# EAGLE design shock dyno (EAGLE 9.6.2)
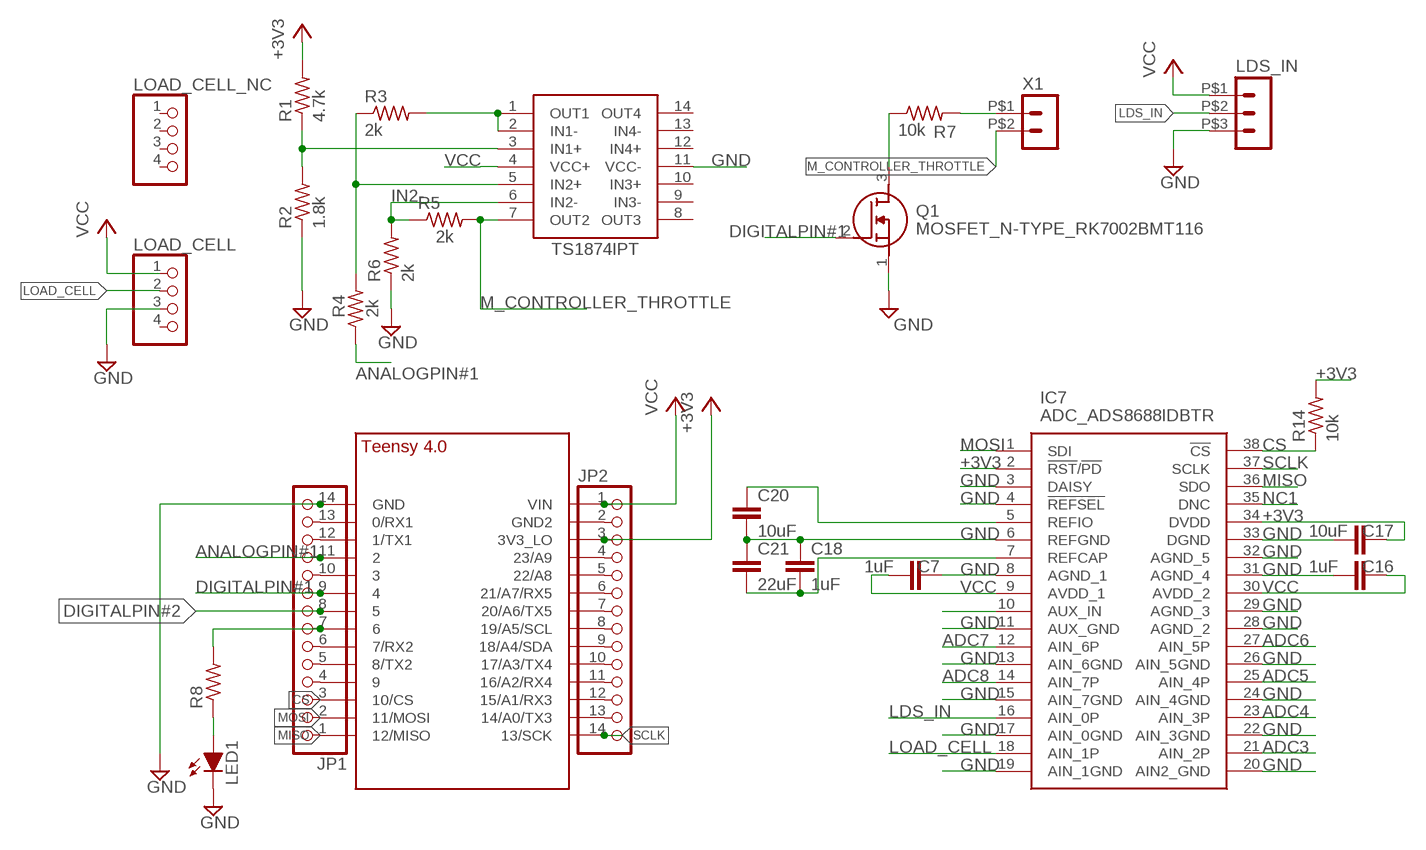
[diagram p0: schematic, sheet 1]

## Parts
C7  1uF  CAP_SMDC0603  [C0603]
C16  1uF  CAP_SMDC0603  [C0603]
C17  10uF  CAP_SMDC0603  [C0603]
C18  1uF  CAP_SMDC0603  [C0603]
C20  10uF  CAP_SMDC0805  [C0805]
C21  22uF  CAP_SMDC1210  [C1210]
IC7  ADC_ADS8688IDBTR  [SOP50P640X120-38N]
JP1  PINHD-1X14  [1X14]
JP2  PINHD-1X14  [1X14]
LDS_IN  HEADER_POS3_43650-0300  [43650-0300]
LED1  LED-5MM  [LED-5MM]
LOAD_CELL  PINHD-1X4  [1X04]
LOAD_CELL_NC  PINHD-1X4  [1X04]
Q1  MOSFET_N-TYPE_RK7002BMT116  [BSS64AHZGT116]
R1  4.7k  RES_SMDR0603  [R0603]
R2  1.8k  RES_SMDR0603  [R0603]
R3  2k  RES_SMDR0603  [R0603]
R4  2k  RES_SMDR0603  [R0603]
R5  2k  RES_SMDR0603  [R0603]
R6  2k  RES_SMDR0603  [R0603]
R7  10k  RES_SMDR0603  [R0603]
R8  RES_SMDR0603  [R0603]
R14  10k  RES_SMDR0603  [R0603]
U$1  TS1874IPT  [TSSOP14]
U$2  TEENSY_4.0_SIMPLE  [TEENSY_4.0_SIMPLE]
X1  HEADER_POS2_43650-0200  [43650-0200]

## Nets
+3V3: C17.1 IC7.2(!RST!/!PD) IC7.34(DVDD) JP2.3 R1.2 R14.2 U$2.3V3_LO
ADC3: IC7.21(AIN_2P)
ADC4: IC7.23(AIN_3P)
ADC5: IC7.25(AIN_4P)
ADC6: IC7.27(AIN_5P)
ADC7: IC7.12(AIN_6P)
ADC8: IC7.14(AIN_7P)
ANALOGPIN#1: JP1.11 R4.1 U$2.2
CS: IC7.38(!CS) JP1.3 R14.1 U$2.10/CS
DIGITALPIN#1: JP1.9 Q1.2(G) U$2.4/CANRX
DIGITALPIN#2: JP1.8 U$2.5
GND: C7.1 C16.2 C17.2 C18.1 C20.2 C21.1 IC7.3(DAISY) IC7.4(!REFSEL) IC7.6(REFGND) IC7.8(AGND_1) IC7.11(AUX_GND) IC7.13(AIN_6GND) IC7.15(AIN_7GND) IC7.17(AIN_0GND) IC7.19(AIN_1GND) IC7.20(AIN2_GND) IC7.22(AIN_3GND) IC7.24(AIN_4GND) IC7.26(AIN_5GND) IC7.28(AGND_2) IC7.29(AGND_3) IC7.31(AGND_4) IC7.32(AGND_5) IC7.33(DGND) JP1.14 LDS_IN.P$3 LED1.K(C) LOAD_CELL.3 Q1.1(S) R2.1 R6.1 U$1.11(VCC-) U$2.GND
IN2-: R5.1 R6.2 U$1.6(IN2-)
LDS_IN: IC7.16(AIN_0P) LDS_IN.P$2
LOAD_CELL: IC7.18(AIN_1P) LOAD_CELL.2
M_CONTROLLER_THROTTLE: R5.2 U$1.7(OUT2) X1.P$2
MISO: IC7.36(SDO) JP1.1 U$2.12/MISO
MOSI: IC7.1(SDI) JP1.2 U$2.11/MOSI
N$1: R1.1 R2.2 U$1.3(IN1+)
N$2: R3.1 R4.2 U$1.5(IN2+)
N$3: R3.2 U$1.1(OUT1) U$1.2(IN1-)
N$4: R7.2 X1.P$1
N$5: JP1.4 U$2.9/CS
N$6: JP1.5 U$2.8(8/TX2)
N$7: JP1.10 U$2.3/CANTX
N$8: JP1.6 U$2.7(7/RX2)
N$10: Q1.3(D) R7.1
N$11: LED1.A R8.1
N$13: JP1.7 R8.2 U$2.6
N$14: JP1.12 U$2.1/TX(1/TX1)
N$15: JP1.13 U$2.0/RX(0/RX1)
N$16: JP2.2 U$2.GND2
N$17: JP2.4 U$2.23/A9
N$18: JP2.5 U$2.22/A8
N$19: JP2.6 U$2.21/A7(21/A7/RX5)
N$20: JP2.7 U$2.20/A6(20/A6/TX5)
N$21: JP2.8 U$2.19/A5/SCL
N$22: JP2.9 U$2.18/A4/SDA
N$23: JP2.10 U$2.17/A3(17/A3/TX4)
N$24: JP2.11 U$2.16/A2(16/A2/RX4)
N$25: JP2.12 U$2.15/A1(15/A1/RX3)
N$26: JP2.13 U$2.14/A0(14/A0/TX3)
N$29: C18.2 C21.2 IC7.7(REFCAP)
N$30: IC7.10(AUX_IN)
N$31: C20.1 IC7.5(REFIO)
NC1: IC7.35(DNC)
SCLK: IC7.37(SCLK) JP2.14 U$2.13/SCK
VCC: C7.2 C16.1 IC7.9(AVDD_1) IC7.30(AVDD_2) JP2.1 LDS_IN.P$1 LOAD_CELL.1 U$1.4(VCC+) U$2.VIN
Unconnected: LOAD_CELL.4 LOAD_CELL_NC.1 LOAD_CELL_NC.2 LOAD_CELL_NC.3 LOAD_CELL_NC.4 U$1.8(OUT3) U$1.9(IN3-) U$1.10(IN3+) U$1.12(IN4+) U$1.13(IN4-) U$1.14(OUT4)

## Library data of the parts
C7 C16-C18 C20 C21 = GTOR - Passive Components:CAP_SMD: CAPACITOR, European symbol; SPICEPREFIX: C
IC7 = GTOR - Active Components:ADC_ADS8688IDBTR: Octal Channel Single ADC SAR 500ksps 16-bit Serial 38-Pin TSSOP T/R Source: Datasheet <https://www.arrow.com/en/products/ads8688idbtr/texas-instruments>; ARROW_PART_NUMBER: ADS8688IDBTR; ARROW_PRICE-STOCK: https://www.arrow.com/en/products/ads8688idbtr/texas-instruments?region=nac; DESCRIPTION: Octal Channel Single ADC SAR 500ksps 16-bit Serial 38-Pin TSSOP T/R; HEIGHT: 1.2mm; MANUFACTURER_NAME: Texas Instruments; MANUFACTURER_PART_NUMBER: ADS8688IDBTR; MOUSER_PART_NUMBER: 595-ADS8688IDBTR; MOUSER_PRICE-STOCK: https://www.mouser.co.uk/ProductDetail/Texas-Instruments/ADS8688IDBTR?qs=bZA2O%252B%252B1GJuPFEagMJIgMw%3D%3D
JP1 JP2 = GTOR - Connectors:PINHD-1X14: PIN HEADER
LDS_IN = GTOR - Microfit Connector:HEADER_POS3_?: Molex - Micro-Fit 3.0 Series connector, 3.00mm (0.118") pitch header, 3 positions.
LED1 = GTOR - Passive Components:LED: Light Emitting Diode (LED) Source: Dangerous Prototypes Eagle Library <https://github.com/DangerousPrototypes/Eagle_Part_Library>
LOAD_CELL LOAD_CELL_NC = GTOR - Connectors:PINHD-1X4: PIN HEADER
Q1 = GTOR - Active Components:MOSFET_N-TYPE_RK7002BMT116: 2.5V Drive Nch MOSFET: MOSFETs are made as ultra-low ON-resistance by the micro-processing technologies suitable for mobilr equipment for low current consumption. In wide lineup including compact type, high-power type and complex type to meet in the market. Source: Datasheet <https://datasheet.datasheetarchive.com/originals/distributors/DKDS-18/356920.pdf>; DESCRIPTION: 2.5V Drive Nch MOSFET: MOSFETs are made as ultra-low ON-resistance by the micro-processing technologies suitable for mobilr equipment for low current consumption. In wide lineup including compact type, high-power type and complex type to meet in the market.; HEIGHT: 1.2mm; MANUFACTURER_NAME: ROHM Semiconductor; MANUFACTURER_PART_NUMBER: RK7002BMT116; MOUSER_PART_NUMBER: 755-RK7002BMT116; MOUSER_PRICE-STOCK: https://www.mouser.co.uk/ProductDetail/ROHM-Semiconductor/RK7002BMT116?qs=npTsUczJOtO4aXz%2Fx%2FNVUw%3D%3D
R1-R8 R14 = GTOR - Passive Components:RES_SMD: RESISTOR, American symbol; SPICEPREFIX: R
U$1 = GTOR - Active Components:TS1874IPT
U$2 = GTOR - Microcontroller:TEENSY_4.0_SIMPLE
X1 = GTOR - Microfit Connector:HEADER_POS2_?: Molex - Micro-Fit 3.0 Series connector, 3.00mm (0.118") pitch header, 2 positions.

## Board
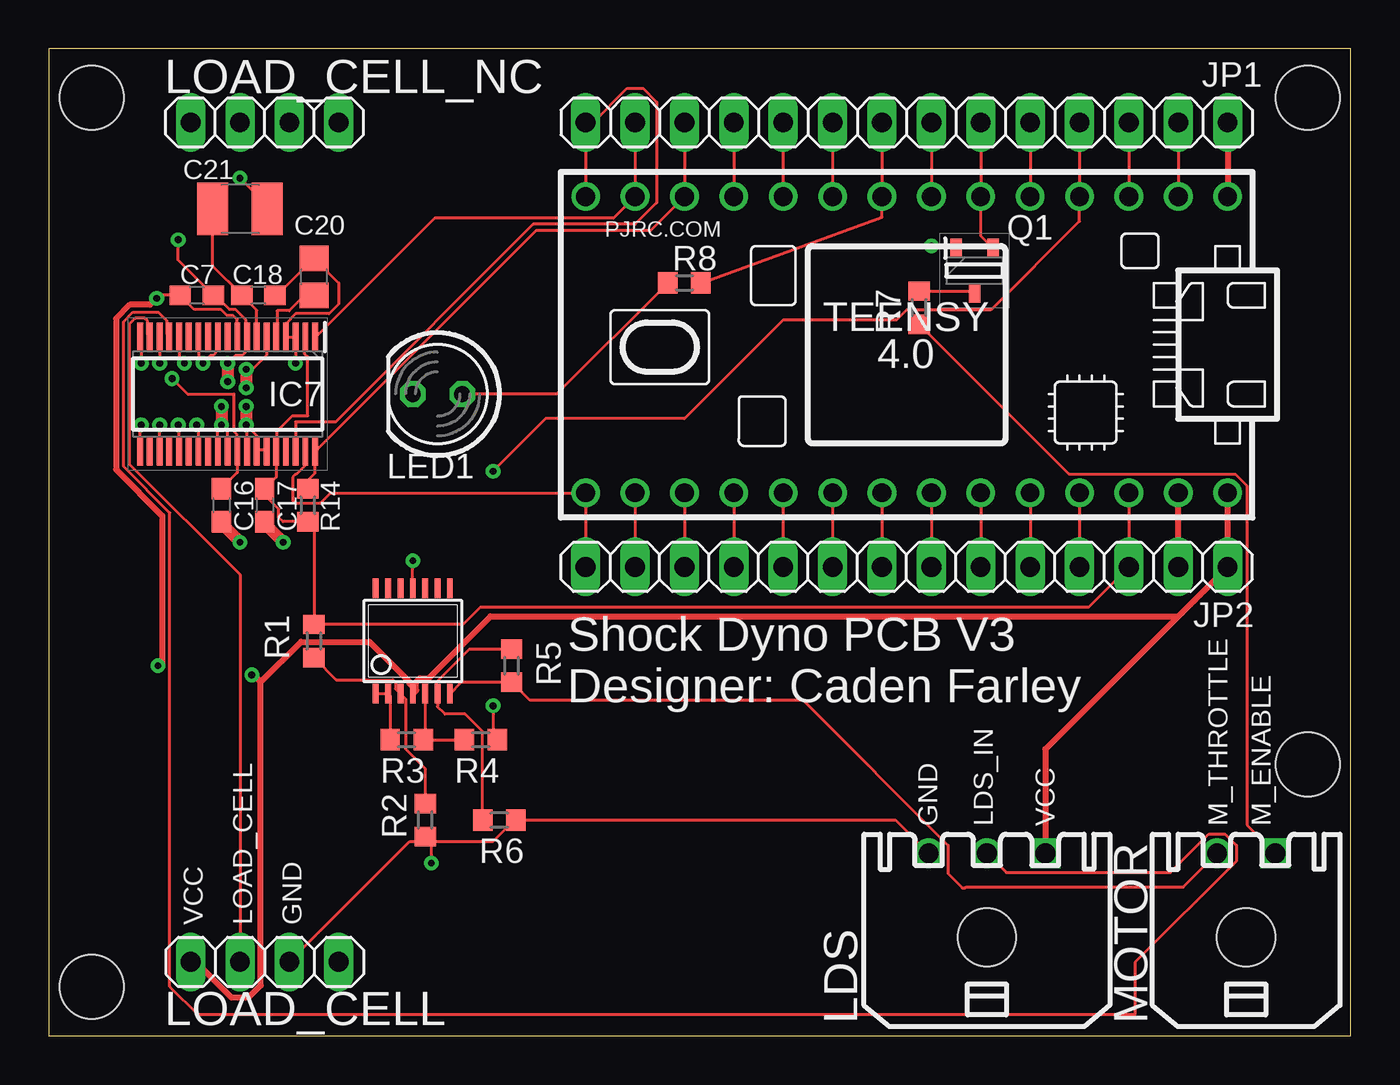
[diagram p1: board, top side]
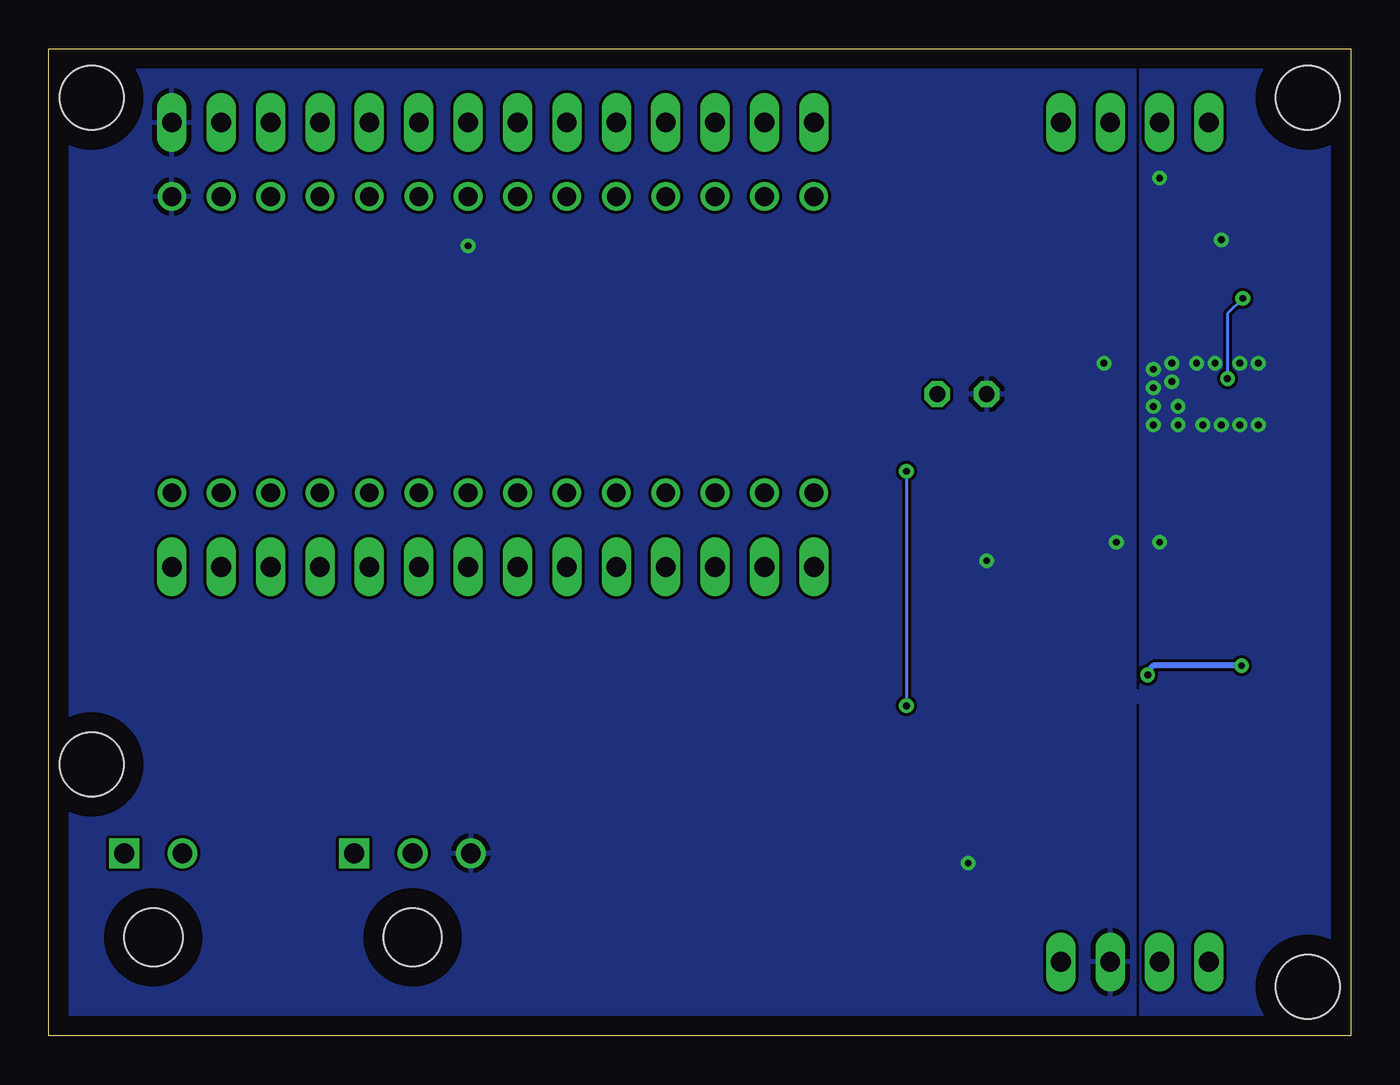
[diagram p2: board, bottom side, seen from below]

Size 66.98 x 50.79 mm. Coordinates in mm from the lower left corner, seen from the top.
Outline: 0,0 66.98,0 66.98,50.79 0,50.79 0,0
Copper layers (1*16): Top 0.035mm / dielectric 1.5mm / Bottom 0.035mm
Design rules "default": minimum track width 6mil, minimum drill 0.35mm, track to track 6mil, track to pad 6mil, pad to pad 6mil, via to via 6mil, smd to smd 6mil, copper to edge 40mil, drill to drill 6mil, minimum pad ring 10mil, minimum via ring 8mil, stop-mask expansion 4mil, vias tented up to drill 0mil, thermal gap 10mil
Holes 3.3 mm at 2.22,48.26 64.77,48.26 2.22,2.54 64.77,13.97

### Footprints (pad centres in the part's own frame; a part is rotated, then mirrored left to right if it is on the bottom)
C0603 = smd 1.1 x 1: 1 -0.85,0; 2 0.85,0
C0805 = smd 1.3 x 1.5: 1 -0.95,0; 2 0.95,0
C1210 = smd 1.6 x 2.7: 1 -1.4,0; 2 1.4,0
SOP50P640X120-38N = smd 1.475 x 0.3: 1 -2.938,4.5; 2 -2.938,4; 3 -2.938,3.5; 4 -2.938,3; 5 -2.938,2.5; 6 -2.938,2; 7 -2.938,1.5; 8 -2.938,1; 9 -2.938,0.5; 10 -2.938,0; 11 -2.938,-0.5; 12 -2.938,-1; 13 -2.938,-1.5; 14 -2.938,-2; 15 -2.938,-2.5; 16 -2.938,-3; 17 -2.938,-3.5; 18 -2.938,-4; 19 -2.938,-4.5; 20 2.938,-4.5; 21 2.938,-4; 22 2.938,-3.5; 23 2.938,-3; 24 2.938,-2.5; 25 2.938,-2; 26 2.938,-1.5; 27 2.938,-1; 28 2.938,-0.5; 29 2.938,0; 30 2.938,0.5; 31 2.938,1; 32 2.938,1.5; 33 2.938,2; 34 2.938,2.5; 35 2.938,3; 36 2.938,3.5; 37 2.938,4; 38 2.938,4.5
1X14 = drill 1.016 long: 1 -16.51,0; 2 -13.97,0; 3 -11.43,0; 4 -8.89,0; 5 -6.35,0; 6 -3.81,0; 7 -1.27,0; 8 1.27,0; 9 3.81,0; 10 6.35,0; 11 8.89,0; 12 11.43,0; 13 13.97,0; 14 16.51,0
43650-0300 = drill 1.02 square: P$1 3,4.32 | drill 1.02: P$2 0,4.32; P$3 -3,4.32 | hole 3: 0,0
LED-5MM = drill 0.813 octagon: A -1.27,0; K 1.27,0
1X04 = drill 1.016 long: 1 -3.81,0; 2 -1.27,0; 3 1.27,0; 4 3.81,0
BSS64AHZGT116 = smd 1 x 0.6: 1 -1.15,-0.95; 2 -1.15,0.95; 3 1.15,0
R0603 = smd 1 x 1.1: 1 -0.85,0; 2 0.85,0
TSSOP14 = smd 0.305 x 0.991: 1 -1.905,-2.718; 2 -1.27,-2.718; 3 -0.635,-2.718; 4 0,-2.718; 5 0.635,-2.718; 6 1.27,-2.718; 7 1.905,-2.718; 8 1.905,2.718; 9 1.27,2.718; 10 0.635,2.718; 11 0,2.718; 12 -0.635,2.718; 13 -1.27,2.718; 14 -1.905,2.718
TEENSY_4.0_SIMPLE = drill 0.965: 0/RX -13.97,-7.62; 1/TX -11.43,-7.62; 2 -8.89,-7.62; 3/CANTX -6.35,-7.62; 3V3_LO -11.43,7.62; 4/CANRX -3.81,-7.62; 5 -1.27,-7.62; 6 1.27,-7.62; 7 3.81,-7.62; 8 6.35,-7.62; 9/CS 8.89,-7.62; 10/CS 11.43,-7.62; 11/MOSI 13.97,-7.62; 12/MISO 16.51,-7.62; 13/SCK 16.51,7.62; 14/A0 13.97,7.62; 15/A1 11.43,7.62; 16/A2 8.89,7.62; 17/A3 6.35,7.62; 18/A4/SDA 3.81,7.62; 19/A5/SCL 1.27,7.62; 20/A6 -1.27,7.62; 21/A7 -3.81,7.62; 22/A8 -6.35,7.62; 23/A9 -8.89,7.62; GND -16.51,-7.62; GND2 -13.97,7.62; VIN -16.51,7.62
43650-0200 = drill 1.02 square: P$1 1.5,4.32 | drill 1.02: P$2 -1.5,4.32 | hole 3: 0,0

### Placement (x,y rotation side)
C7  7.62,38.1 180 top
C16  8.89,27.3 270 top
C17  11.11,27.3 270 top
C18  10.79,38.1 180 top
C20  13.65,39.05 90 top
C21  9.84,42.54 180 top
IC7  9.21,33.02 270 top
JP1  44.13,46.99 0 top
JP2  44.13,24.13 180 top
LDS_IN  48.26,5.08 0 top
LED1  20,33.02 180 top
LOAD_CELL  11.11,3.81 0 top
LOAD_CELL_NC  11.11,46.99 180 top
Q1  47.62,39.37 270 top
R1  13.65,20.32 90 top
R2  19.37,11.11 90 top
R3  18.41,15.24 180 top
R4  22.23,15.24 180 top
R5  23.81,19.05 270 top
R6  23.18,11.11 180 top
R7  44.77,37.46 270 top
R8  32.7,38.73 0 top
R14  13.33,27.3 270 top
U$1  18.73,20.32 0 top
U$2  44.13,35.56 180 top
X1  61.59,5.08 0 top

### Tracks (layer width: path | path; a pad name or v marks a point on that pad's centre or on a via)
+3V3
  Top 0.152: U$2.3V3_LO JP2.3 53.5,22.07 22.23,22.07 21.33,21.17 R1.2 13.65,26.35 13.33,26.35 R14.2 12.06,26.45 11.84,26.67 11.84,27.1 11.11,27.83 C17.1 11.71,28.75 IC7.34 11.75,30.16 11.75,31.12 12.54,31.91 13.33,31.91 13.33,34.92 13.18,35.08 13.18,35.88 IC7.2
ANALOGPIN#1  (via drill 0.35)
  Top 0.152: JP1.11 U$2.2 53.02,41.91 48.46,37.34 44.12,37.34 43.61,36.83 37.78,36.83 32.7,31.75 25.56,31.75 v22.86,29.05 | R4.1 22.86,15.45 v22.86,16.99
  Bottom 0.152: v22.86,29.05 v22.86,16.99
CS
  Top 0.152: JP1.3 U$2.10/CS 30.96,41.43 25.08,41.43 13.81,30.16 IC7.38 13.71,28.95 13.33,28.57 R14.1
DIGITALPIN#1
  Top 0.152: JP1.9 U$2.4/CANRX 47.94,41.15 Q1.2
DIGITALPIN#2
  Top 0.152: JP1.8 U$2.5
GND  (via drill 0.35)
  Top 0.152: v19.69,8.89 19.69,9.95 R2.1 19.69,10 | v12.7,34.61 v12.71,34.62 IC7.3 IC7.4 12.21,36.65 12.7,37.15 14.42,37.15 14.92,37.65 14.92,38.73 C20.2 13.65,39.85 13.49,39.85 11.75,38.1 C18.1 | IC7.31 10.21,31.38 v10.16,31.43 10.71,30.88 IC7.32 10.79,30.16 11.11,30.16 IC7.33 | IC7.29 9.21,31.12 v8.89,31.43 8.71,31.25 IC7.28 | IC7.26 7.71,31.34 v7.62,31.43 | IC7.24 6.71,31.39 v6.67,31.43 | IC7.22 v5.71,31.42 v5.71,31.43 | IC7.20 4.71,31.38 v4.76,31.43 | IC7.19 4.76,35.9 v4.76,34.61 | IC7.17 v5.71,34.61 | IC7.15 6.71,34.88 v6.99,34.61 | IC7.13 7.71,34.84 v7.94,34.61 8.32,34.99 8.45,34.99 8.71,35.25 IC7.11 | v9.21,34.61 9.59,34.99 9.95,34.99 10.21,35.25 IC7.8 10.16,36.01 10.16,36.83 9.62,37.37 9.3,37.37 8.57,38.1 C7.1 6.67,39.9 v6.67,40.96 | IC7.6 11.21,35.02 10.48,34.29 v10.16,34.29 | 19.69,10 22.86,10 23.97,11.11 R6.1 43.55,11.11 LDS_IN.P$3 | U$1.11 v18.73,24.45 | Q1.1 45.52,40.52 v45.4,40.64 | LOAD_CELL.3 18.57,10 19.69,10 | v9.84,44.13 11.24,42.73 C21.1
  Top 0.305: JP1.14 U$2.GND
  Top 0.61: v9.21,34.61 v9.21,33.65 | v10.16,34.29 v10.16,33.34 | v10.16,32.38 v10.16,31.43 | v8.89,32.38 v8.89,31.43 | v9.84,25.4 8.89,26.35 C16.2 | v12.06,25.4 11.11,26.35 C17.2
  pour Bottom (rank 3): -1.27,52.07 -1.27,-1.27 10.79,-1.27 10.79,17.14 11.11,17.14 11.11,-1.27 68.58,-1.27 68.58,52.07 11.11,52.07 11.11,17.78 10.79,17.78 10.79,52.07
IN2-
  Top 0.152: R6.2 22.33,15.66 21.43,16.56 20.39,16.56 19.99,16.96 20,16.97 U$1.6 19.94,17.67 19.94,18.19 21.65,19.9 R5.1
LDS_IN
  Top 0.152: LDS_IN.P$2 49.25,8.41 57.7,8.41 59.68,10.39 60.51,10.39 61.09,9.81 61.09,8.99 55.88,3.78 55.88,1.09 7.68,1.09 6.24,2.54 6.24,26.91 3.85,29.3 3.85,36.74 4.34,37.23 5.65,37.23 6.09,36.79 6.09,36.08 IC7.16
LOAD_CELL
  Top 0.152: IC7.18 5.09,36.08 5.09,36.79 4.95,36.92 4.46,36.92 4.16,36.62 4.16,29.42 9.84,23.74 LOAD_CELL.2
M_CONTROLLER_THROTTLE
  Top 0.152: U$1.7 21.23,18.2 R5.2 24.74,17.28 38.79,17.28 46.25,9.81 46.25,8.36 46.99,7.62 47.13,7.62 47.19,7.67 58.37,7.67 X1.P$2
MISO
  Top 0.152: U$2.12/MISO JP1.1 28,46.99 29.75,48.74 30.57,48.74 31.27,48.04 31.27,42.86 30.16,41.75 24.92,41.75 14.76,31.59 12.7,31.59 12.7,30.16 IC7.36
MOSI
  Top 0.152: JP1.2 U$2.11/MOSI 29.05,42.07 19.84,42.07 13.81,36.04 IC7.1
N$1
  Top 0.152: R1.1 14.8,18.33 17.71,18.33 17.84,18.19 17.84,17.86 U$1.3 18.35,17.35 18.35,14.78 19.37,13.76 R2.2
N$2
  Top 0.152: U$1.5 19.37,15.34 R3.1 R4.2
N$3
  Top 0.152: U$1.1 U$1.2 17.56,17.5 R3.2
N$4
  Top 0.152: R7.2 52.48,28.9 61.04,28.9 61.63,28.31 61.63,10.86 X1.P$1
N$5
  Top 0.152: JP1.4 U$2.9/CS
N$6
  Top 0.152: JP1.5 U$2.8
N$7
  Top 0.152: JP1.10 U$2.3/CANTX
N$8
  Top 0.152: JP1.6 U$2.7
N$10
  Top 0.152: R7.1 47.53,38.31 Q1.3
N$11
  Top 0.152: R8.1 26.14,33.02 LED1.A
N$13
  Top 0.152: JP1.7 U$2.6 42.86,42.12 R8.2
N$14
  Top 0.152: JP1.12 U$2.1/TX
N$15
  Top 0.152: JP1.13 U$2.0/RX
N$16
  Top 0.305: JP2.2 U$2.GND2
N$17
  Top 0.152: U$2.23/A9 JP2.4
N$18
  Top 0.152: U$2.22/A8 JP2.5
N$19
  Top 0.152: U$2.21/A7 JP2.6
N$20
  Top 0.152: U$2.20/A6 JP2.7
N$21
  Top 0.152: U$2.19/A5/SCL JP2.8
N$22
  Top 0.152: U$2.18/A4/SDA JP2.9
N$23
  Top 0.152: U$2.17/A3 JP2.10
N$24
  Top 0.152: U$2.16/A2 JP2.11
N$25
  Top 0.152: U$2.15/A1 JP2.12
N$26
  Top 0.152: U$2.14/A0 JP2.13
N$29
  Top 0.152: IC7.7 10.71,37.34 C18.2 8.44,39.6 C21.2
N$31
  Top 0.152: IC7.5 11.75,36.04 11.75,37.31 12.38,37.31 13.18,38.1 C20.1
SCLK
  Top 0.152: JP2.14 U$2.13/SCK 14.49,27.94 13.98,27.43 12.69,27.43 12.56,27.56 12.56,28.75 12.69,28.88 12.72,28.88 13.21,29.37 IC7.37
VCC  (via drill 0.35)
  Top 0.152: C16.1 9.71,28.97 IC7.30 9.68,30.16 9.68,30.96 9.53,31.12 9.53,33.02 7.14,33.02 v6.35,33.81 | IC7.9 9.71,36.85 9.49,37.07 9.17,37.07 8.87,37.37 7.5,37.37 C7.2 5.71,38.1 v5.56,37.94
  Top 0.305: U$2.VIN JP2.1 58.1,21.59 | LDS_IN.P$1 51.26,14.75 58.1,21.59 | 58.1,21.59 22.72,21.59 19.53,18.4 19.09,18.4 18.91,18.22 18.91,17.78 | U$1.4 18.91,17.78 | 18.91,17.78 18.55,18.14 18.55,18.22 16.5,20.27 12.98,20.27 10.91,18.21 | LOAD_CELL.1 7.57,3.81 9.4,1.98 10.28,1.98 10.91,2.61 10.91,18.21 | v5.56,37.94 5.22,37.61 4.18,37.61 3.47,36.9 3.47,29.14 5.85,26.75 5.85,19.05 v5.63,19.05 | v10.45,18.57 10.54,18.57 10.91,18.21
  Bottom 0.152: v6.35,33.81 6.35,37.15 v5.56,37.94
  Bottom 0.305: v5.63,19.05 10.16,19.05 10.48,18.73 10.48,18.6 v10.45,18.57

### Text on the board
tPlace: Shock Dyno PCB V3 / Designer: Caden Farley | GND | LDS_IN | VCC | M_THROTTLE | M_ENABLE | VCC | LOAD_CELL | GND | LDS | MOTOR